# Altium schematic sheet HAE_Sensors.SchDoc
size A; SheetNumber: 5; SheetTotal: 6
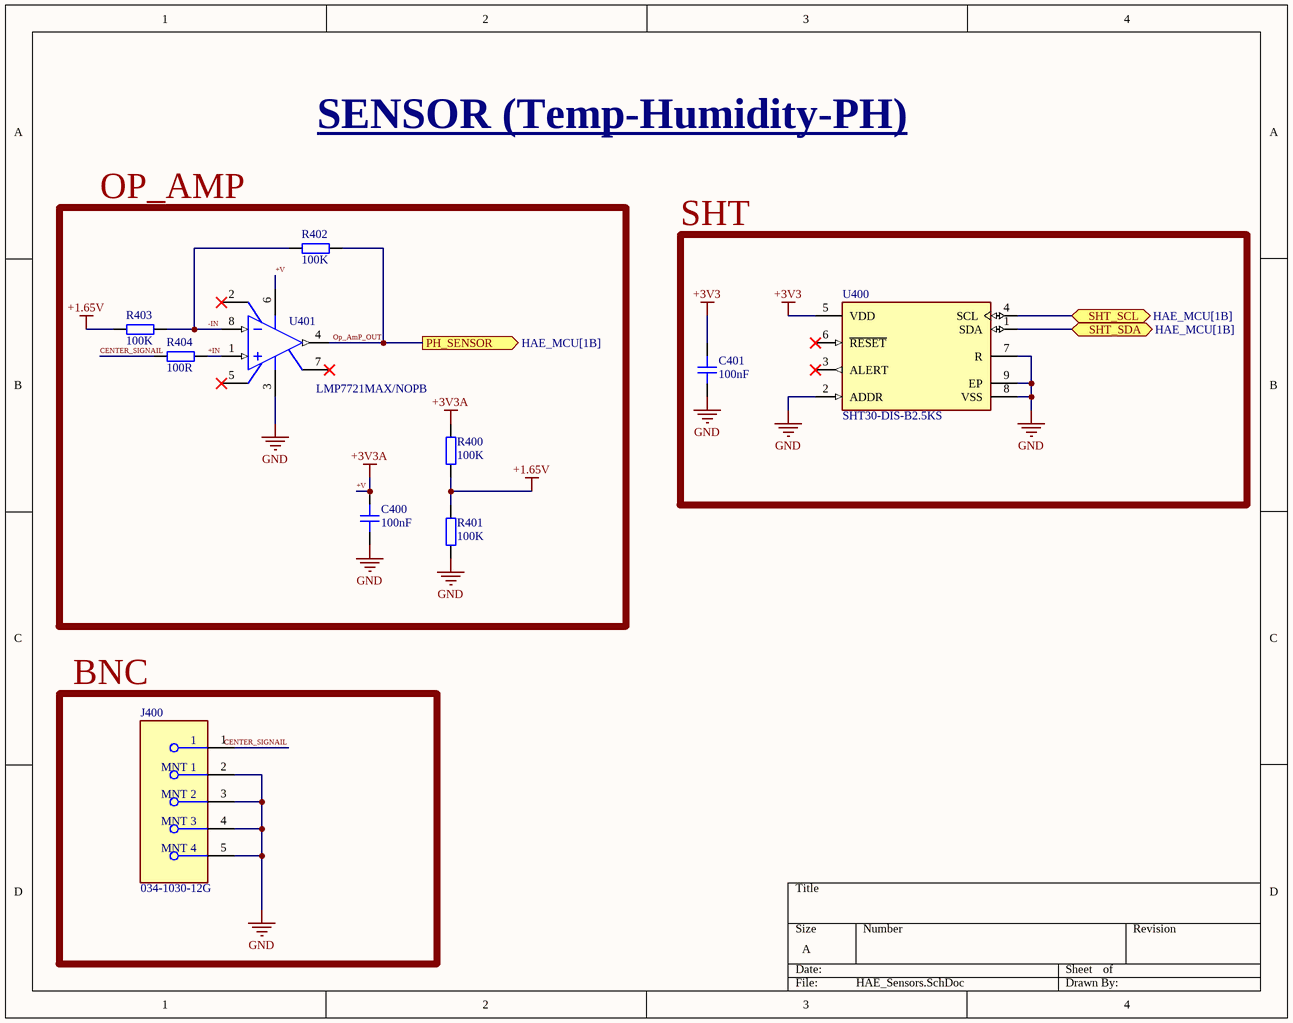
[diagram p0: HAE_Sensors.SchDoc]

## Parts
C400  100nF  [CAP_0603]
C401  100nF  [CAP_0603]
J400  034-1030-12G  [FP-034-1030-12G-MFG]
R400  100K  [RES_0402]
R401  100K  [RES_0402]
R402  100K  [RES_0402]
R403  100K  [RES_0402]
R404  100R  [RES_0402]
U400  SHT30-DIS-B2.5KS  [FP-SHT30-DIS-B2_5KS-MFG]
U401  LMP7721MAX/NOPB  [D0008A_L]

## Blocks framed on the sheet
OP_AMP: C400 R400-R404 U401
SHT: C401 U400
BNC: J400

## Ports
PH_SENSOR (out, see HAE_MCU[1B]), SHT_SCL (bidir, see HAE_MCU[1B]), SHT_SDA (bidir, see HAE_MCU[1B])

## Nets
+1.65V: R400.2 R401.1 R403.1
+3V3: C401.2 U400.5(VDD)
+V: C400.2 R400.1 U401.6(V+)  [also labelled +3V3A]
GND: C400.1 C401.1 J400.2(MNT_1) J400.3(MNT_2) J400.4(MNT_3) J400.5(MNT_4) R401.2 U400.2(ADDR) U400.7(R) U400.8(VSS) U400.9(EP) U401.3(V-)
+IN: R404.1 U401.1(IN+)
-IN: R402.2 R403.2 U401.8(IN-)
CENTER_SIGNAIL: J400.1 R404.2
Op_AmP_OUT: R402.1 U401.4(OUT) ; port PH_SENSOR
SHT_SCL: U400.4(SCL) ; port SHT_SCL
SHT_SDA: U400.1(SDA) ; port SHT_SDA

Not connected (* = marked no-connect by the designer): U400 3(ALERT)* 6(~{RESET})*; U401 2(NC)* 5(NC)* 7(NC)*

## Notes on the sheet
- SENSOR (Temp-Humidity-PH)

## Library data of the parts
C400 C401 = CAP_0603: Capacitor SMD 0603; Manufacturer: *; Manufacturer Part Number: *; Distributor Link: *; LCSC: *; Rating: *; Dielectric: *
J400 = CMP-20040-000010-1: CONN HDBNC JACK R/A 75 OHM PCB; Connector Type: BNC; Body Plating: Nickel; Impedance: 75R; Max Frequency: 18GHz; Body Material: Brass; Dielectric Material: PTFE; Housing Color: Silver; Contact Plating: Gold; Max Operating Temperature: 165°C; Package Quantity: 100; RoHS Compliant: Yes; Packaging: Bulk; Fastening Type: Bayonet; Termination: Solder; Contact Material: Copper; Min Operating Temperature: -65°C; Mount: Through Hole
R400-R404 = RES_0402: Resistor SMD 0402; Manufacturer: *; Manufacturer Part Number: *; Distributor Link: *; LCSC: *
U400 = CMP-144040-000006-1: SENSOR HUMID/TEMP 5V I2C 3% SMD
U401 = CMP-0055-00396-3: 3 Femtoampere Input Bias Current Precision Amplifier, 8-pin Narrow SOIC, Pb-Free; Manufacturer: Texas Instruments; PackageTopMarking: NSZXTT*LMP77*21MA; PowerWise: Y; CompType: Amplifiers; ComponentLink1URL: http://www.ti.com/general/docs/lit/getliterature.tsp?genericPartNumber=LMP7721&fileType=pdf; PinCount: 8; PackageDescription: SOIC Narrow, 4.9 x 3.9 x 1.45mm, 8 Lead, 1.27mm Pitch; ComponentLink1Description: Datasheet URL; Code_JEDEC: MS-012-AA; RoHS: Y; Package Reference: D0008A; Code_IPC: SOIC127P600-8